# EAGLE design bbf-dc-outputs (EAGLE 9.4.2)
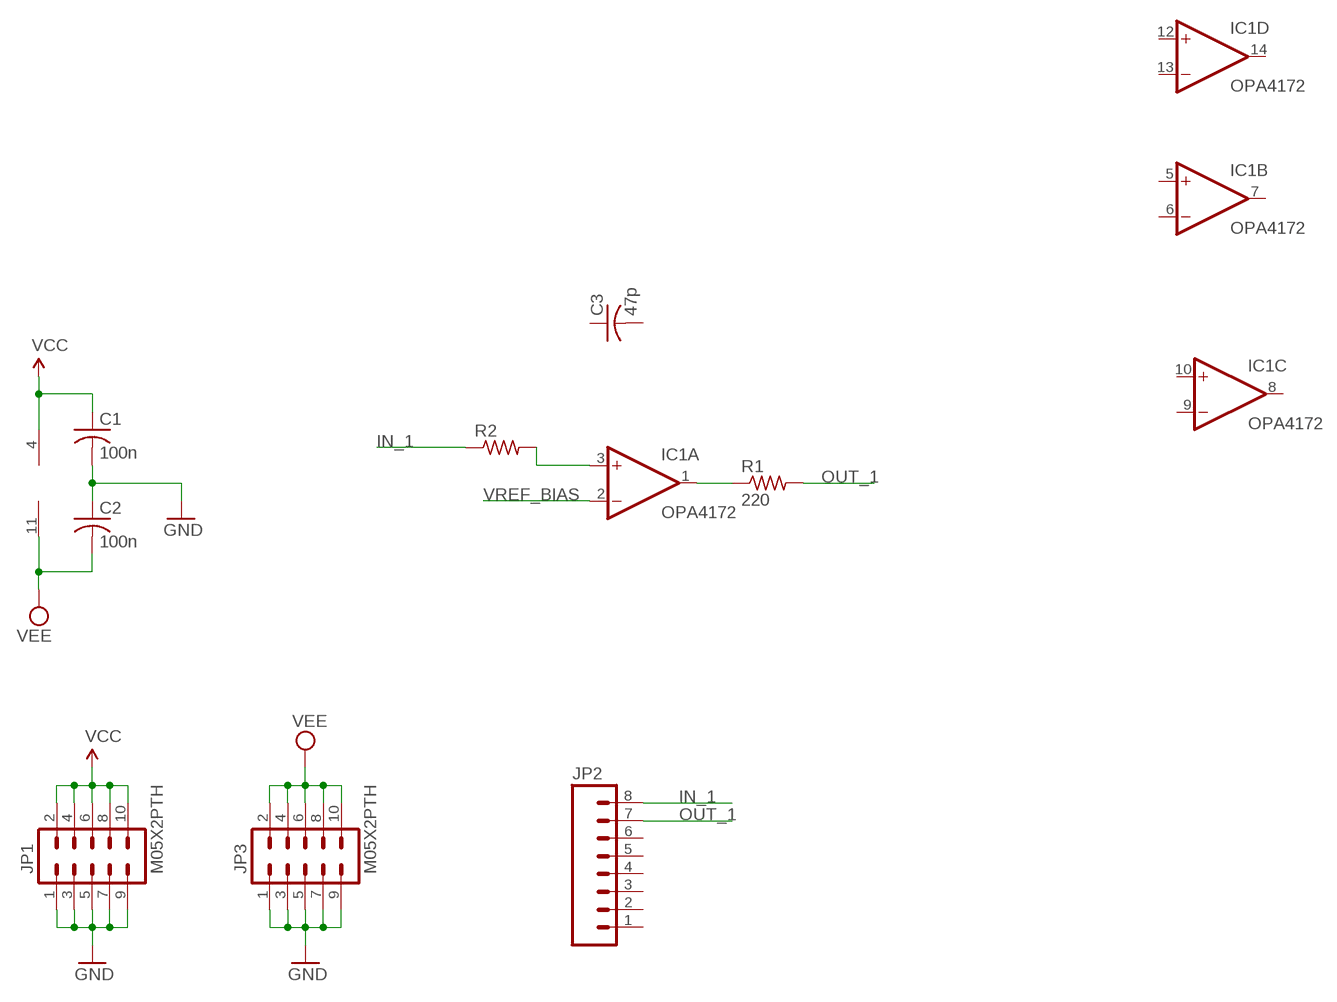
[diagram p0: schematic, sheet 1]

## Parts
C1  100n  C-USC0805  [C0805]
C2  100n  C-USC0805  [C0805]
C3  47p  C-USC0805  [C0805]
IC1  OPA4172  OPA4172IDR_SO14  [SO14]
JP1  M05X2PTH  [AVR_ICSP]
JP2  M08  [1X08]
JP3  M05X2PTH  [AVR_ICSP]
R1  220  R-US_R0805  [R0805]
R2  R-US_R0805  [R0805]

## Nets
GND: C1.2 C2.1 JP1.1 JP1.3 JP1.5 JP1.7 JP1.9 JP3.1 JP3.3 JP3.5 JP3.7 JP3.9
IN_1: JP2.8 R2.1
N$1: IC1.1(A:OUT) R1.1
N$2: IC1.3(A:+IN) R2.2
OUT_1: JP2.7 R1.2
VCC: C1.1 IC1.4(P:V+) JP1.2 JP1.4 JP1.6 JP1.8 JP1.10
VEE: C2.2 IC1.11(P:V-) JP3.2 JP3.4 JP3.6 JP3.8 JP3.10
VREF_BIAS: IC1.2(A:-IN)
Unconnected: C3.1 C3.2 IC1.5(B:+IN) IC1.6(B:-IN) IC1.7(B:OUT) IC1.8(C:OUT) IC1.9(C:-IN) IC1.10(C:+IN) IC1.12(D:+IN) IC1.13(D:-IN) IC1.14(D:OUT) JP2.1 JP2.2 JP2.3 JP2.4 JP2.5 JP2.6

## Library data of the parts
C1-C3 = rcl:C-US: CAPACITOR, American symbol; SPICEPREFIX: C
IC1 = Homemade:OPA4172IDR: 36-V, Single-Supply, 10-MHz, Rail-to-Rail Output, Operational Amplifier
JP1 JP3 = SparkFun:M05X2: Header 5x2 Standard 10-pin dual row 0.1" header. Commonly used with AVR-ISP. Use with Spark Fun Electronics SKU: PRT-00778
JP2 = SparkFun:M08: Header 8 Standard 8-pin 0.1" header. Use with straight break away headers (SKU : PRT-00116), right angle break away headers (PRT-00553), swiss pins (PRT-00743), machine pins (PRT-00117), and female headers (PRT-00115).
R1 R2 = rcl:R-US_: RESISTOR, American symbol; SPICEPREFIX: R

## Net classes
0 default: width 0.305 mm, drill 0.508 mm, clearance 0.254 mm
2 POWER: width 0.406 mm, drill 0.508 mm, clearance 0.254 mm

## Board
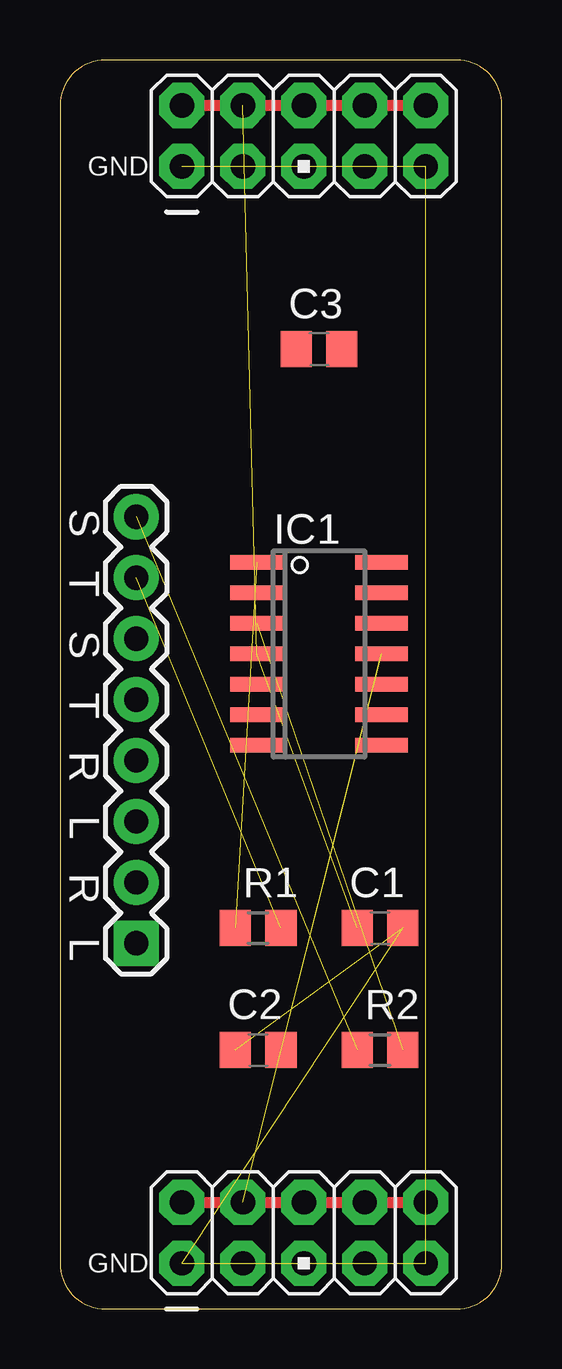
[diagram p1: board, top side]
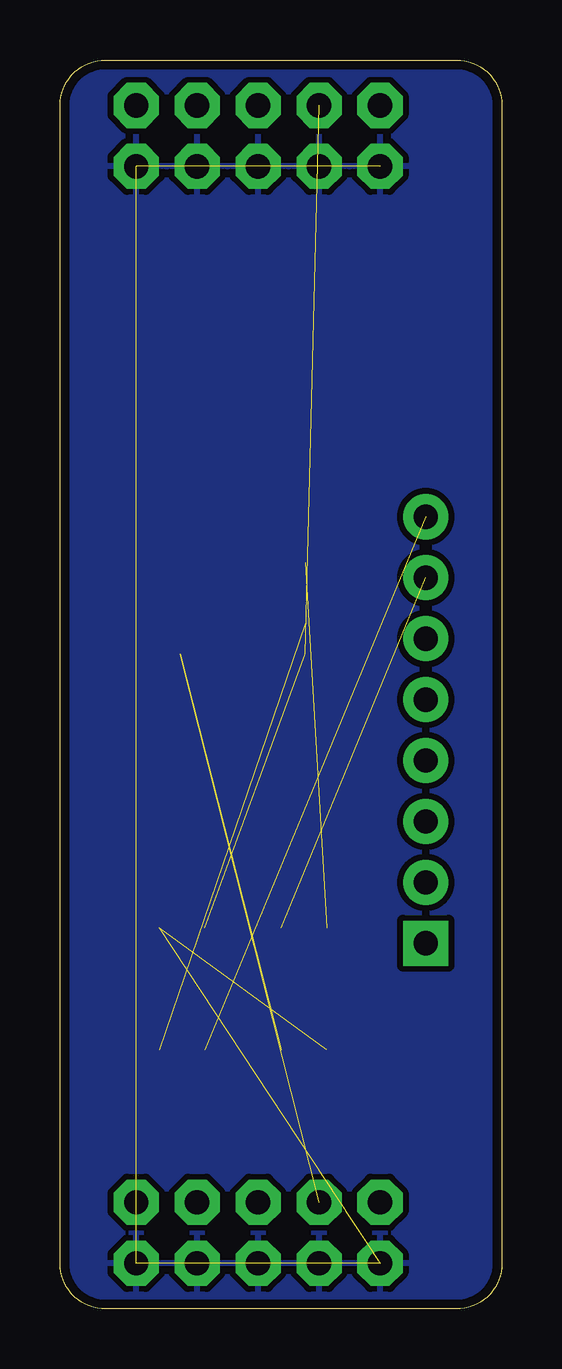
[diagram p2: board, bottom side, seen from below]

Size 18.41 x 52.06 mm. Coordinates in mm from the lower left corner, seen from the top.
Outline: 16.51,0 arc90 18.41,1.91 18.41,50.16 arc90 16.52,52.06 1.89,52.06 arc90 0,50.16 0,1.91 arc90 1.91,0 16.51,0
Copper layers (1*16): Top 0.035559375mm / dielectric 1.6mm / Bottom 0.035559375mm
Design rules "oshpark-2layer": minimum track width 6mil, minimum drill 10mil, track to track 6mil, track to pad 6mil, pad to pad 6mil, via to via 6mil, smd to smd 6mil, copper to edge 15mil, drill to drill 6mil, minimum pad ring 5mil, minimum via ring 5mil, stop-mask expansion 2.5mil, vias tented up to drill 0mil, thermal gap 10mil

### Footprints (pad centres in the part's own frame; a part is rotated, then mirrored left to right if it is on the bottom)
C0805 = smd 1.3 x 1.5: 1 -0.95,0; 2 0.95,0
SO14 = smd 0.6 x 2.2: 1 -3.81,-2.6; 2 -2.54,-2.6; 3 -1.27,-2.6; 4 0,-2.6; 5 1.27,-2.6; 6 2.54,-2.6; 7 3.81,-2.6; 8 3.81,2.6; 9 2.54,2.6; 10 1.27,2.6; 11 0,2.6; 12 -1.27,2.6; 13 -2.54,2.6; 14 -3.81,2.6
AVR_ICSP = drill 1.016 pad 1.88 octagon: 1 -1.27,5.08; 2 1.27,5.08; 3 -1.27,2.54; 4 1.27,2.54; 5 -1.27,0; 6 1.27,0; 7 -1.27,-2.54; 8 1.27,-2.54; 9 -1.27,-5.08; 10 1.27,-5.08
1X08 = drill 1.016 pad 1.88 square: 1 0,0 | drill 1.016 pad 1.88: 2 2.54,0; 3 5.08,0; 4 7.62,0; 5 10.16,0; 6 12.7,0; 7 15.24,0; 8 17.78,0
R0805 = smd 1.3 x 1.5: 1 -0.95,0; 2 0.95,0

### Placement (x,y rotation side)
C1  13.34,15.88 0 top
C2  8.26,10.79 0 top
C3  10.79,40.01 0 top
IC1  10.79,27.3 270 top
JP1  10.16,48.9 90 top
JP2  3.17,15.24 90 top
JP3  10.16,3.17 90 top
R1  8.26,15.88 0 top
R2  13.34,10.79 0 top

### Tracks (layer width: path | path; a pad name or v marks a point on that pad's centre or on a via)
GND  (11 unrouted)
  pour Bottom: 16.51,0 arc90 18.41,1.91 18.41,50.16 arc90 16.51,52.07 1.91,52.07 arc90 0,50.16 0,1.91 arc90 1.91,0
IN_1  (1 unrouted)
N$1  (1 unrouted)
N$2  (1 unrouted)
OUT_1  (1 unrouted)
VCC  (2 unrouted)
  Top 0.457: JP1.2 JP1.4 JP1.6 JP1.8 JP1.10
VEE  (2 unrouted)
  Top 0.457: JP3.2 JP3.4 JP3.6 JP3.8 JP3.10

### Text on the board
tPlace: GND | S | T | S | T | R | L | R | L | GND